# Altium schematic sheet sheet2_power.SchDoc: Proximo: Power
size A4; Organization: Ideetron B.V.; Address1: Dorpstraat 81; Address2: 3941 JL Doorn; Address3: 3941 JL Doorn; Address4: The Netherlands; DocumentNumber: 1; SheetNumber: 2
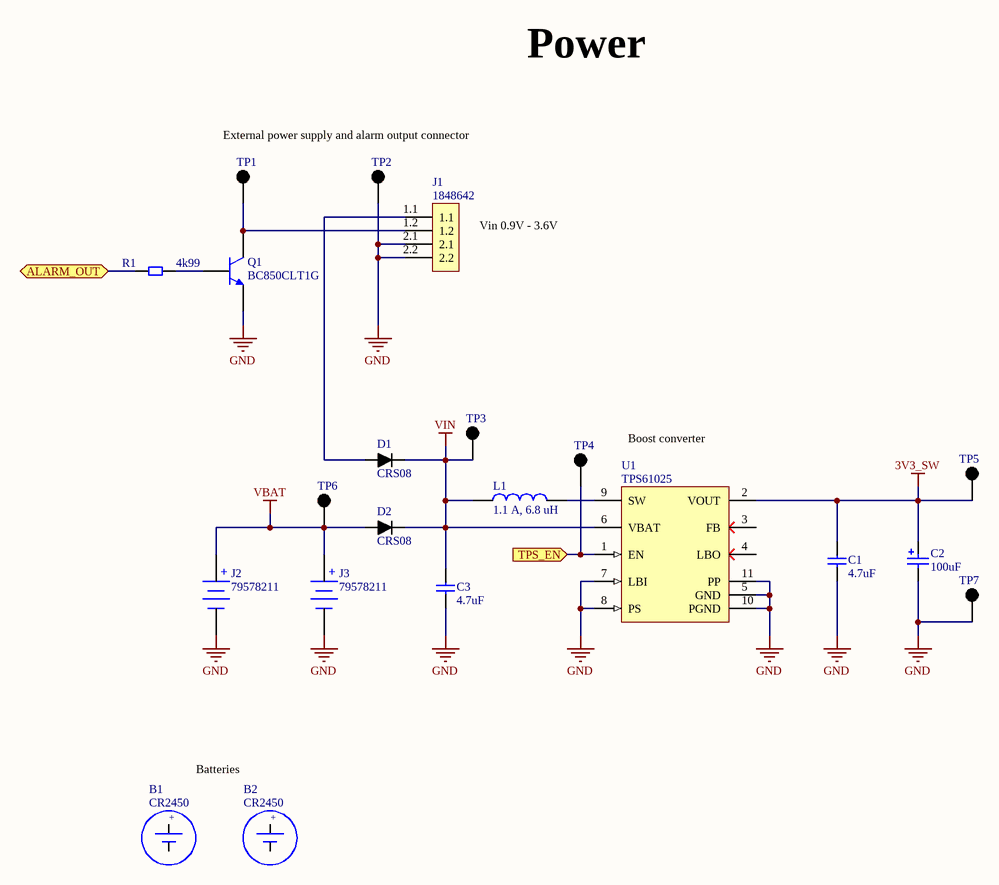
[diagram p0: sheet2_power.SchDoc]

## Parts
B1  CR2450
B2  CR2450
C1  4.7uF  [CAP0603_GR18_MURATA]
C2  100uF  [WCAP-PSHP_D10mm x L8.7mm]
C3  4.7uF  [CAP0603_GR18_MURATA]
D1  CRS08  [SOD-123F]
D2  CRS08  [SOD-123F]
J1  1848642  [Phoenix 1848642]
J2  79578211  [79578211]
J3  79578211  [79578211]
L1  1.1 A, 6.8 uH  [WE-MAPI_3015]
Q1  BC850CLT1G  [SOT23]
R1  4k99  [RES0603VISHAY]
TP1  testpad  [TestPad]  (value not drawn)  (no BOM)
TP2  testpad  [TestPad]  (value not drawn)  (no BOM)
TP3  testpad  [TestPad]  (value not drawn)  (no BOM)
TP4  testpad  [TestPad]  (value not drawn)  (no BOM)
TP5  testpad  [TestPad]  (value not drawn)  (no BOM)
TP6  testpad  [TestPad]  (value not drawn)  (no BOM)
TP7  testpad  [TestPad]  (value not drawn)  (no BOM)
U1  TPS61025  [DRC10-2400X1650TP]

## Ports
ALARM_OUT (bidir), TPS_EN (in)

## Nets
3V3_SW: C1.2 C2.1(P) TP5.1 U1.2(VOUT)
GND: C1.1 C2.2(N) C3.1 J1.2.1 J1.2.2 J2.2(Neg) J3.2(Neg) Q1.3 TP2.1 TP7.1 U1.5(GND) U1.7(LBI) U1.8(PS) U1.10(PGND) U1.11(PP)
VBAT: D2.A J2.1(Pos) J3.1(Pos) TP6.1
VIN: C3.2 D1.C D2.C L1.1 TP3.1 U1.6(VBAT)
ALARM_OUT: R1.1 ; port ALARM_OUT
TPS_EN: TP4.1 U1.1(EN) ; port TPS_EN
NetD1_A: D1.A J1.1.1
NetJ1_1.2: J1.1.2 Q1.1 TP1.1
NetL1_2: L1.2 U1.9(SW)
NetQ1_2: Q1.2 R1.2

Not connected (* = marked no-connect by the designer): U1 3(FB) 4(LBO)

## Notes on the sheet
- Power
- External power supply and alarm output connector
- (near J1) Vin 0.9V - 3.6V
- Boost converter
- (near B2) Batteries
- Title
- Size:
- A4
- Number:
- Revision:
- Date:
- Time:
- Sheet
- of
- (in symbol 79578211) +
- (in symbol Battery LCC 2450) +

## Library data of the parts
B1 B2 = Battery LCC 2450: CR2450 Coin cell battery; Manufacturer: Eve Energy; Remark: Coincell battery to be placed in the Battery holders J2 and J3; Sponsor: Elincom electronics; Value: CR2450; Package: CR2450
C1 C3 = CAP_0603_4u7: Capacitor X5R 0603 Murata; Manufacturer Part Number: GRM188R60J475KE19D; Sponsor: Nijkerk Electronics; Manufacturer: Murata; Pin Count: 2; Value: 4.7uF
C2 = 875115560004: WCAP-PSHP Aluminum Polymer Capacitors, D10mm x L8.7mm, 100 uF, 25 VDC; Manufacturer: Wurth Elektronik; Rated Voltage: 25 VDC; ComponentLink1Description: Manufacturer; ComponentLink1URL: http://www.we-online.de; ComponentLink2Description: Datasheet; ComponentLink2URL: http://katalog.we-online.de/pbs/datasheet/875115560004.pdf; Manufacturer Part Number: 875115560004; Published Date: Dec. 2017; Publisher: Wurth Elektronik; Size: D10mm x L8.7mm; Capacitance: 100 uF; Life Cycle: 2000 h; Operating Temperature: -55 to +105 degC; Sponsor: Wurth Elektronik; Value: 100uF
D1 D2 = CRS08 Schottky Diode: Manufacturer: Tohsiba; value: CRS08; Manufacturer Part Number: CRS08; Supplier 1: Mouser; Supplier Part Number 1: 757-CRS08(TE85R,Q,M)
J1 = Phoenix Connector: Plug component, Push-in spring connection; Manufacturer: Phoenix Contact; value: 1848642; Supplier 1: Digi-Key; Supplier 2: Mouser; Supplier Part Number 1: 277-12224-ND; Supplier Part Number 2: 651-1848642; Manufacturer Part Number: 1848642; Sponsor: Phoenix Contact
J2 J3 = 79578211: Battery Holder WA-BCPH, Battery Type: 2450p; BatteryType: 2450; Sponsor: Wurth Elektronik; PublishedDate: Nov. 2016; ComponentLink1Description: Manufacturer; ComponentLink1URL: http://www.we-online.de; ComponentLink2Description: Datasheet; ComponentLink2URL: http://katalog.we-online.de/em/datasheet/79578211.pdf; Publisher: Wurth Elektronik; value: 79578211; Manufacturer Part Number: 79578211; Manufacturer: Wurth Elektronik
L1 = 74438335068: WE-MAPI SMD Shielded Power Inductor, size 3015, 1.1 A, 6.8 uH; Manufacturer: Wurth Elektronik; Rated Current: 1.1 A; Inductance: 6.8 uH; DC Resistance max.: 287 mOhm; Value: 6.8 uH; ComponentLink1Description: Manufacturer; ComponentLink1URL: http://www.we-online.de; ComponentLink2Description: Datasheet; ComponentLink2URL: http://katalog.we-online.de/pbs/datasheet/74438335068.pdf; Published Date: Nov. 2017; Size: 3015; Operating Temperature: -40 to 125 degC; Manufacturer Part Number: 74438335068; Publisher: Wurth Elektronik; Sponsor: Wurth Elektronik
Q1 = BC850C: NPN general purpose transistor; Manufacturer: On Semiconductor; Manufacturer Part Number: NSVBC850CLT1G; value: BC850CLT1G; Supplier 1: Mouser; Supplier Part Number 1: 863-NSVBC850CLT1G; Sponsor: *
R1 = Resistor_4k99: SMD Resistor 4k99 0603; Manufacturer: Vishay; Manufacturer Part Number: CRCW06034K99FKTABC; Sponsor: MyProto - DVC; Value: 4k99; Supplier 1: *; Supplier Part Number 1: *; Remark: *
TP1-TP7 = TestPad: Signal probe pad; value: testpad
U1 = TPS61025DRCR: Boost Voltage Converter with 0.9 to 6.5 V Input, -40 to 85 degC, 10-Pin SON (DRC), Green (RoHS & no Sb/Br); Manufacturer: Texas Instruments; Preset Vout(V): 3.3; Regulated Outputs(#): 1; SubFamily: Step-Up Regulator; Switching Frequency(Max)(kHz): 720; Synchronous Rectification: TRUE; Vin(Max)(V): 6.5; Vin(Min)(V): 0.9; DatasheetVersion: SLVS451F; PackageVersion: revL, Sep-2011; PackageReference: DRC10-2400X1650TP; PackageDescription: 10-Pin Plastic Small Outline No-Lead, 3 x 3 x 1 mm Body, 0.5 mm Pitch, Exposed Pad; Supplier 1: Digi-Key; Supplier Part Number 1: 296-15844-2-ND; Supplier 2: Digi-Key; Supplier Part Number 2: 296-15844-1-ND; Supplier 3: Digi-Key; Supplier Part Number 3: 296-15844-6-ND; Supplier 4: Farnell; Supplier Part Number 4: 1703402; Supplier 5: Newark; Supplier Part Number 5: 87H2896; Supplier 6: Mouser; Supplier Part Number 6: 595-TPS61025DRCR; Eco-Plan: Green (RoHS & no Sb/Br); Topology: Boost; Mounting Technology: Surface Mount; ComponentLink1Description: Datasheet; ComponentLink1URL: http://www.ti.com/general/docs/lit/getliterature.tsp?genericPartNumber=TPS61025&fileType=pdf; ComponentLink2Description: Package Specification; ComponentLink2URL: http://www.ti.com/litv/pdf/mpds117k; value: TPS61025; Manufacturer Part Number: TPS61025DRCR